# EAGLE schematic Motherboard (EAGLE 9.1.3)
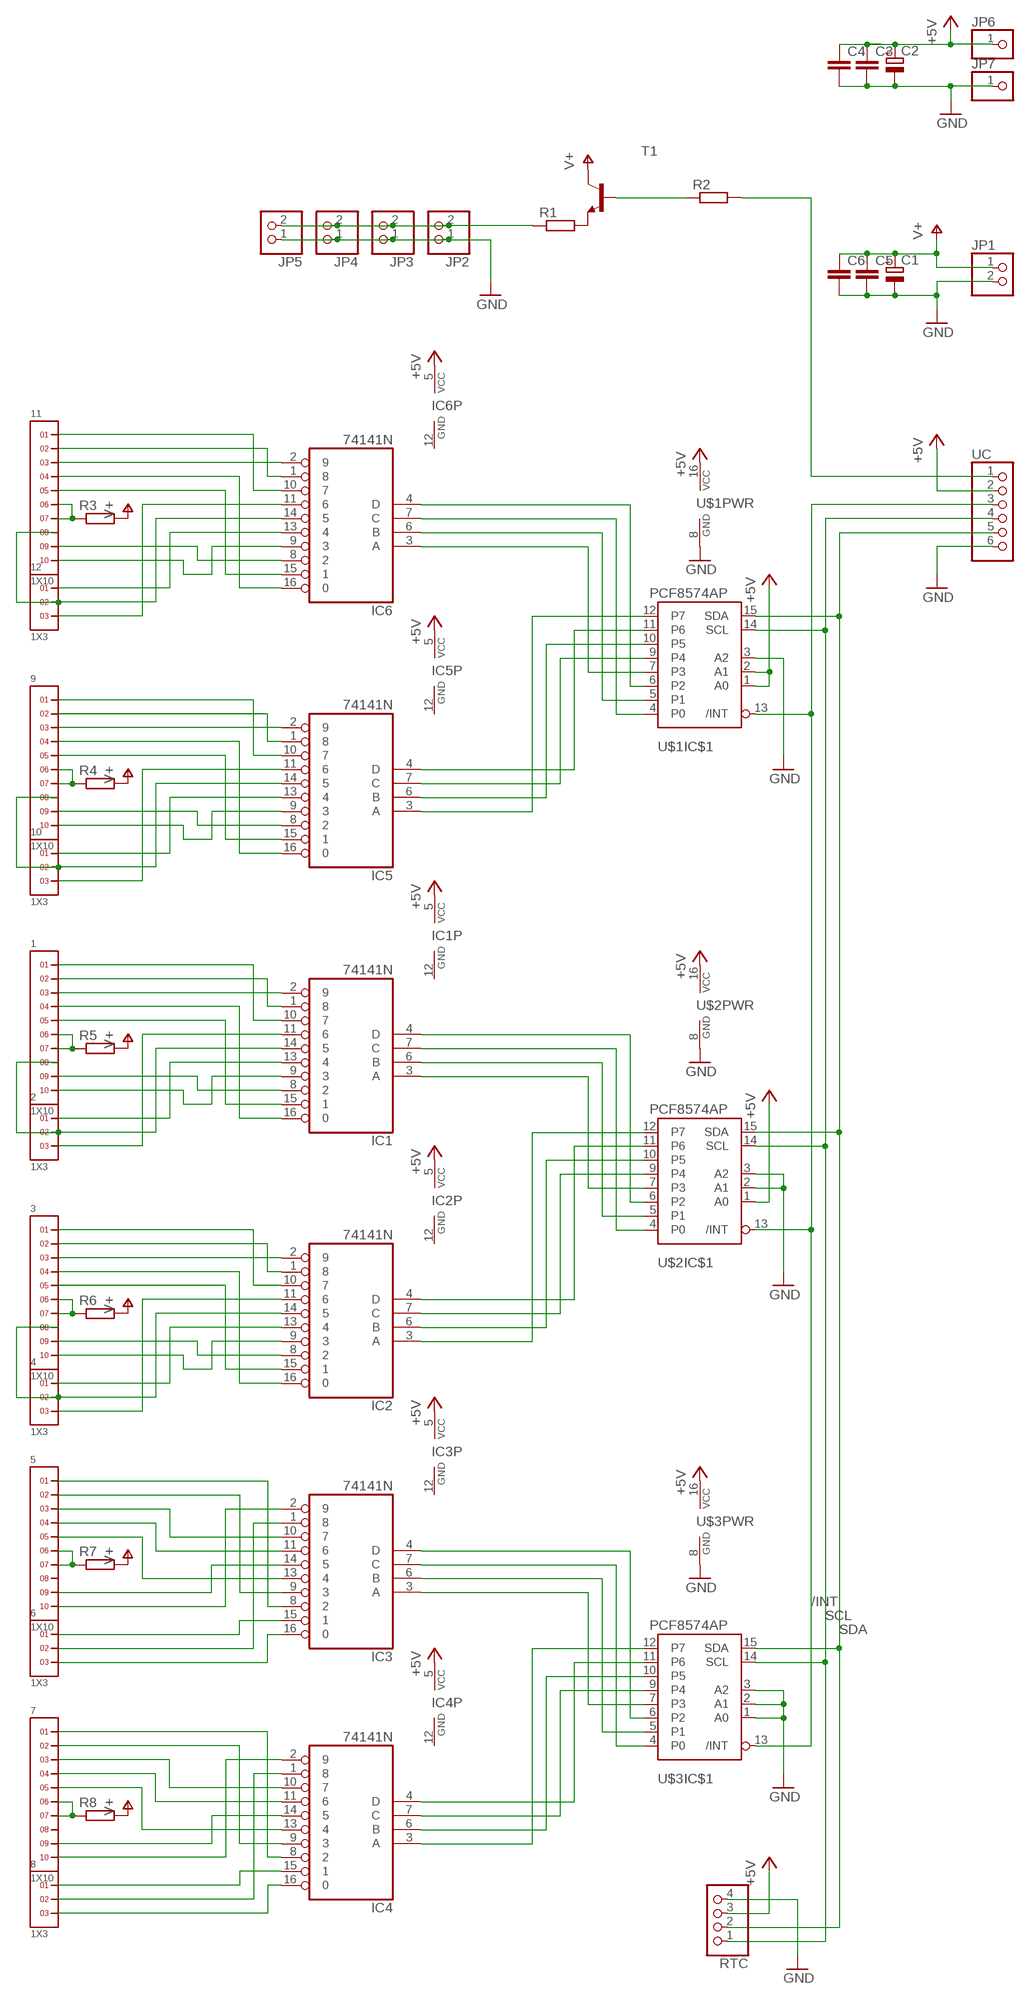
[diagram p0: schematic, sheet 1]

## Parts
1  1X10  [1X10]
2  1X3  [1X3]
3  1X10  [1X10]
4  1X3  [1X3]
5  1X10  [1X10]
6  1X3  [1X3]
7  1X10  [1X10]
8  1X3  [1X3]
9  1X10  [1X10]
10  1X3  [1X3]
11  1X10  [1X10]
12  1X3  [1X3]
C1  CPOL-EUE2,5-6E  [E2,5-6E]
C2  CPOL-EUE2,5-6E  [E2,5-6E]
C3  C-EU050-024X044  [C050-024X044]
C4  C-EU050-024X044  [C050-024X044]
C5  C-EU050-024X044  [C050-024X044]
C6  C-EU050-024X044  [C050-024X044]
IC1  74141N  [DIL16]
IC2  74141N  [DIL16]
IC3  74141N  [DIL16]
IC4  74141N  [DIL16]
IC5  74141N  [DIL16]
IC6  74141N  [DIL16]
JP1  PINHD-1X2  [1X02]
JP2  PINHD-1X2  [1X02]
JP3  PINHD-1X2  [1X02]
JP4  PINHD-1X2  [1X02]
JP5  PINHD-1X2  [1X02]
JP6  PINHD-1X1  [1X01]
JP7  PINHD-1X1  [1X01]
R1  R-EU_0613/15  [P0613/15]
R2  R-EU_0207/10  [0207/10]
R3  R-EU_0613/15  [P0613/15]
R4  R-EU_0613/15  [P0613/15]
R5  R-EU_0613/15  [P0613/15]
R6  R-EU_0613/15  [P0613/15]
R7  R-EU_0613/15  [P0613/15]
R8  R-EU_0613/15  [P0613/15]
RTC  PINHD-1X4  [1X04]
T1  MPSA42-NPN-TO92-EBC  [TO92-EBC]
U$1  PCF8574AP  [DIL16]
U$2  PCF8574AP  [DIL16]
U$3  PCF8574AP  [DIL16]
UC  PINHD-1X6  [1X06]

## Nets
+5V: C2.+ C3.1 C4.1 IC1.5(VCC) IC2.5(VCC) IC3.5(VCC) IC4.5(VCC) IC5.5(VCC) IC6.5(VCC) JP6.1 RTC.3 U$1.1(IC$1:A0) U$1.2(IC$1:A1) U$1.16(PWR:VCC) U$2.1(IC$1:A0) U$2.16(PWR:VCC) U$3.16(PWR:VCC) UC.2
/INT: U$1.13(IC$1:/INT) U$2.13(IC$1:/INT) U$3.13(IC$1:/INT) UC.3
GND: C1.- C2.- C3.2 C4.2 C5.2 C6.2 JP1.2 JP2.1 JP3.1 JP4.1 JP5.1 JP7.1 RTC.4 U$1.3(IC$1:A2) U$1.8(PWR:GND) U$2.2(IC$1:A1) U$2.3(IC$1:A2) U$2.8(PWR:GND) U$3.1(IC$1:A0) U$3.2(IC$1:A1) U$3.3(IC$1:A2) U$3.8(PWR:GND) UC.6
N$1: 1.4 IC1.16
N$2: 1.5 IC1.15
N$3: 1.9 IC1.8
N$4: 1.10 IC1.9
N$5: 2.1 IC1.13
N$6: 1.8 2.2 IC1.14
N$7: 2.3 IC1.11
N$8: 1.1 IC1.10
N$9: 1.2 IC1.1
N$10: 1.3 IC1.2
N$11: 3.4 IC2.16
N$12: 3.5 IC2.15
N$13: 3.9 IC2.8
N$14: 3.10 IC2.9
N$15: 4.1 IC2.13
N$16: 3.8 4.2 IC2.14
N$17: 4.3 IC2.11
N$18: 3.1 IC2.10
N$19: 3.2 IC2.1
N$20: 3.3 IC2.2
N$21: 8.3 IC4.16
N$22: 8.2 IC4.1
N$23: 8.1 IC4.15
N$24: 7.10 IC4.2
N$25: 7.9 IC4.14
N$26: 7.5 IC4.13
N$27: 7.4 IC4.11
N$28: 7.3 IC4.10
N$29: 7.2 IC4.9
N$30: 7.1 IC4.8
N$31: 6.3 IC3.16
N$32: 6.2 IC3.1
N$33: 6.1 IC3.15
N$34: 5.10 IC3.2
N$35: 5.9 IC3.14
N$36: 5.5 IC3.13
N$37: 5.4 IC3.11
N$38: 5.3 IC3.10
N$39: 5.2 IC3.9
N$40: 5.1 IC3.8
N$41: 9.4 IC5.16
N$42: 9.5 IC5.15
N$43: 9.9 IC5.8
N$44: 9.10 IC5.9
N$45: 10.1 IC5.13
N$46: 9.8 10.2 IC5.14
N$47: 10.3 IC5.11
N$48: 9.1 IC5.10
N$49: 9.2 IC5.1
N$50: 9.3 IC5.2
N$51: 11.4 IC6.16
N$52: 11.5 IC6.15
N$53: 11.9 IC6.8
N$54: 11.10 IC6.9
N$55: 12.1 IC6.13
N$56: 11.8 12.2 IC6.14
N$57: 12.3 IC6.11
N$58: 11.1 IC6.10
N$59: 11.2 IC6.1
N$60: 11.3 IC6.2
N$61: IC3.4(D) U$3.6(IC$1:P2)
N$62: IC3.7(C) U$3.4(IC$1:P0)
N$63: IC3.6(B) U$3.5(IC$1:P1)
N$64: IC3.3(A) U$3.7(IC$1:P3)
N$65: IC4.4(D) U$3.11(IC$1:P6)
N$66: IC4.7(C) U$3.9(IC$1:P4)
N$67: IC4.6(B) U$3.10(IC$1:P5)
N$68: IC4.3(A) U$3.12(IC$1:P7)
N$69: IC1.4(D) U$2.6(IC$1:P2)
N$70: IC1.7(C) U$2.4(IC$1:P0)
N$71: IC1.6(B) U$2.5(IC$1:P1)
N$72: IC1.3(A) U$2.7(IC$1:P3)
N$73: IC2.4(D) U$2.11(IC$1:P6)
N$74: IC2.7(C) U$2.9(IC$1:P4)
N$75: IC2.6(B) U$2.10(IC$1:P5)
N$76: IC2.3(A) U$2.12(IC$1:P7)
N$77: IC6.4(D) U$1.6(IC$1:P2)
N$78: IC6.7(C) U$1.4(IC$1:P0)
N$79: IC6.6(B) U$1.5(IC$1:P1)
N$80: IC6.3(A) U$1.7(IC$1:P3)
N$81: IC5.4(D) U$1.11(IC$1:P6)
N$82: IC5.7(C) U$1.9(IC$1:P4)
N$83: IC5.6(B) U$1.10(IC$1:P5)
N$84: IC5.3(A) U$1.12(IC$1:P7)
N$87: JP2.2 JP3.2 JP4.2 JP5.2 R1.1
N$89: R2.2 UC.1
N$90: R1.2 T1.E
N$92: 11.6 11.7 R3.1
N$93: 9.6 9.7 R4.1
N$94: 1.6 1.7 R5.1
N$95: 3.6 3.7 R6.1
N$96: 5.6 5.7 R7.1
N$97: 7.6 7.7 R8.1
N$98: R2.1 T1.B
SCL: RTC.1 U$1.14(IC$1:SCL) U$2.14(IC$1:SCL) U$3.14(IC$1:SCL) UC.4
SDA: RTC.2 U$1.15(IC$1:SDA) U$2.15(IC$1:SDA) U$3.15(IC$1:SDA) UC.5
V+: C1.+ C5.1 C6.1 JP1.1 R3.2 R4.2 R5.2 R6.2 R7.2 R8.2 T1.C
Unconnected: 5.8 7.8

## Power pins joined to a net without a drawn wire
GND: IC1.12(GND) IC2.12(GND) IC3.12(GND) IC4.12(GND) IC5.12(GND) IC6.12(GND)

## Library data of the parts
1 3 5 7 9 11 = headers(2mm):1X10
2 4 6 8 10 12 = headers(2mm):1X3
C1 C2 = rcl:CPOL-EU: POLARIZED CAPACITOR, European symbol; SPICEPREFIX: C
C3-C6 = rcl:C-EU: CAPACITOR, European symbol; SPICEPREFIX: C
IC1-IC6 = 74xx-eu:74*141: BCD to decimal DECODER/DRIVER
JP1-JP5 = pinhead:PINHD-1X2: PIN HEADER
JP6 JP7 = pinhead:PINHD-1X1: PIN HEADER
R1-R8 = rcl:R-EU_: RESISTOR, European symbol; SPICEPREFIX: R
RTC = pinhead:PINHD-1X4: PIN HEADER
T1 = transistor:*-NPN-: NPN Transistror BF959 corrected 2008.03.06
U$1-U$3 = i2c:PCF8574: Remote 8-Bit I/O Expander for I²C Bus
UC = pinhead:PINHD-1X6: PIN HEADER